# Altium project Test Board ESP32-S3 Mini.PrjPcb (part 2 of 2)

## Sheet SD-eMMC.SchDoc
size A4
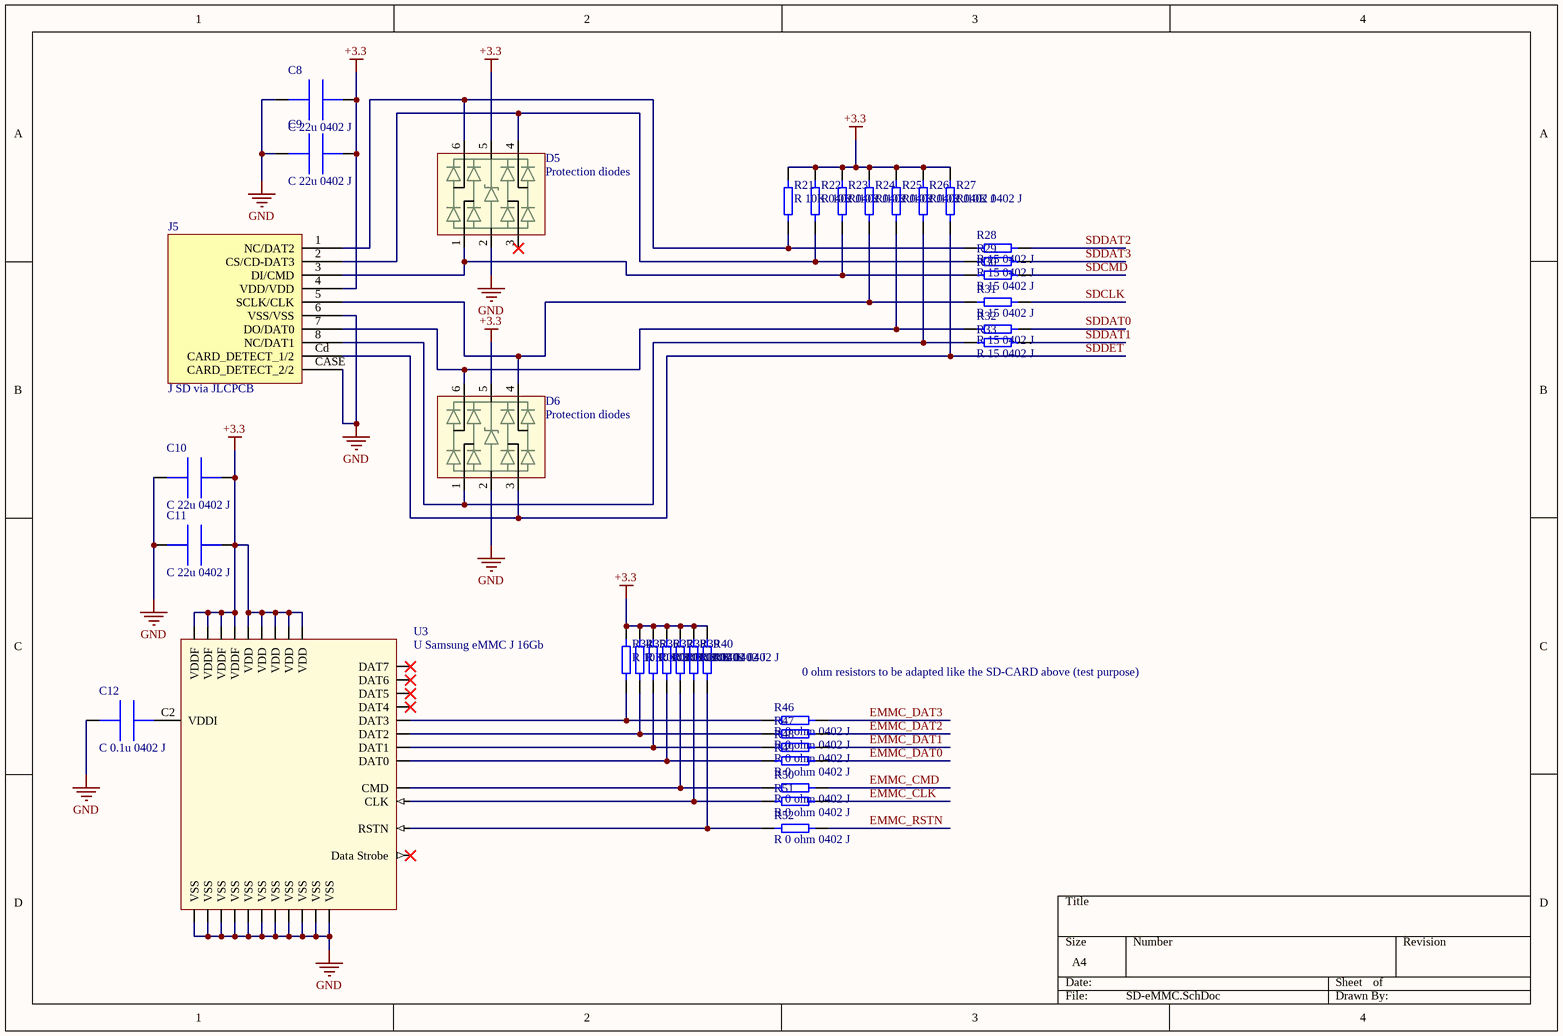
[diagram p3: SD-eMMC.SchDoc]

### Parts
C8  C 22u 0402 J  [C0402]
C9  C 22u 0402 J  [C0402]
C10  C 22u 0402 J  [C0402]
C11  C 22u 0402 J  [C0402]
C12  C 0.1u 0402 J  [C0402]
D5  Protection diodes  [SOT23-SRV05]
D6  Protection diodes  [SOT23-SRV05]
J5  J SD via JLCPCB  [SOFNG TF-15X15 SD JLCPCB]
R21  R 10K 0402 J  [R0402]
R22  R 10K 0402 J  [R0402]
R23  R 10K 0402 J  [R0402]
R24  R 10K 0402 J  [R0402]
R25  R 10K 0402 J  [R0402]
R26  R 10K 0402 J  [R0402]
R27  R 10K 0402 J  [R0402]
R28  R 15 0402 J  [R0402]
R29  R 15 0402 J  [R0402]
R30  R 15 0402 J  [R0402]
R31  R 15 0402 J  [R0402]
R32  R 15 0402 J  [R0402]
R33  R 15 0402 J  [R0402]
R34  R 10K 0402 J  [R0402]
R35  R 10K 0402 J  [R0402]
R36  R 10K 0402 J  [R0402]
R37  R 10K 0402 J  [R0402]
R38  R 10K 0402 J  [R0402]
R39  R 10K 0402 J  [R0402]
R40  R 10K 0402 J  [R0402]
R46  R 0 ohm 0402 J  [R0402]
R47  R 0 ohm 0402 J  [R0402]
R48  R 0 ohm 0402 J  [R0402]
R49  R 0 ohm 0402 J  [R0402]
R50  R 0 ohm 0402 J  [R0402]
R51  R 0 ohm 0402 J  [R0402]
R52  R 0 ohm 0402 J  [R0402]
U3  U Samsung eMMC J 16Gb  [BGA153C50P14X14_1150X1300X92]

### Nets
+3.3: C8.2 C9.2 C10.2 C11.2 D5.5 D6.5 J5.4(VDD/VDD) R21.2 R22.2 R23.2 R24.2 R25.2 R26.2 R27.2 R34.2 R35.2 R36.2 R37.2 R38.1 R39.2 R40.1 U3.C6(VDD) U3.E6(VDDF) U3.F5(VDDF) U3.J10(VDDF) U3.K9(VDDF) U3.M4(VDD) U3.N4(VDD) U3.P3(VDD) U3.P5(VDD)
GND: C8.1 C9.1 C10.1 C11.1 C12.1 D5.2 D6.2 J5.6(VSS/VSS) J5.CASE(CARD_DETECT_2/2) U3.A6(VSS) U3.C4(VSS) U3.E7(VSS) U3.G5(VSS) U3.H10(VSS) U3.J5(VSS) U3.K8(VSS) U3.N2(VSS) U3.N5(VSS) U3.P4(VSS) U3.P6(VSS)
EMMC_CLK: R51.2
EMMC_CMD: R50.2
EMMC_DAT0: R49.2
EMMC_DAT1: R48.2
EMMC_DAT2: R47.2
EMMC_DAT3: R46.2
EMMC_RSTN: R52.2
SDCLK: R31.2
SDCMD: R30.2
SDDAT0: R32.2
SDDAT1: R33.2
SDDAT2: R28.2
SDDAT3: R29.2
SDDET: D6.3 J5.Cd(CARD_DETECT_1/2) R27.1
NetC12_2: C12.2 U3.C2(VDDI)
NetD5_1: D5.1 J5.3(DI/CMD) R23.1 R30.1
NetD5_4: D5.4 J5.2(CS/CD-DAT3) R22.1 R29.1
NetD5_6: D5.6 J5.1(NC/DAT2) R21.1 R28.1
NetD6_1: D6.1 J5.8(NC/DAT1) R26.1 R33.1
NetD6_4: D6.4 J5.5(SCLK/CLK) R24.1 R31.1
NetD6_6: D6.6 J5.7(DO/DAT0) R25.1 R32.1
NetR34_1: R34.1 R46.1 U3.B2(DAT3)
NetR35_1: R35.1 R47.1 U3.A5(DAT2)
NetR36_1: R36.1 R48.1 U3.A4(DAT1)
NetR37_1: R37.1 R49.1 U3.A3(DAT0)
NetR38_2: R38.2 R50.1 U3.M5(CMD)
NetR39_1: R39.1 R51.1 U3.M6(CLK)
NetR40_2: R40.2 R52.1 U3.K5(RSTN)

Not connected (* = marked no-connect by the designer): D5 3*; U3 B3(DAT4)* B4(DAT5)* B5(DAT6)* B6(DAT7)* H5(Data_Strobe)*

### Notes on the sheet
- 0 ohm resistors to be adapted like the SD-CARD above (test purpose)

### Library data of the parts
C8-C11 = C 22u 0402 J: Multi-Layer Ceramic Capacitor 22uF 2.5VDC X6S 20% 0402 Paper T/R GRM155C80E226ME11D; Manufacturer: Murata; Supplier 1: Mouser; Manufacturer Part Number: GRM155C80E226ME11D; RoHS: Yes; Category: Ceramic Capacitors; Stock 1: 30000; Pricing 1: 1=0,32000, 10=0,22300, 50=0,22300, 100=0,13400, 1000=0,08500, 10000=0,06900 (USD); Supplier Part Number 1: 81-GRM155C80E226ME1D; JLCPCB: C907955
C12 = C 0.1u 0402 J: Cap Ceramic 0.1uF 50V X7R 10% Pad SMD 0402 125C Low ESR Automotive CL05B104KB54PNC; Manufacturer: Samsung; Supplier 1: Digi-Key; Manufacturer Part Number: CL05B104KB54PNC; RoHS: Yes; Category: Ceramic Capacitors; Stock 1: 3863336; Pricing 1: 1=0,10000, 10=0,04600, 50=0,02500, 100=0,02040, 500=0,01460, 1000=0,01147, 2500=0,01043, 5000=0,00959 (USD); RoHS Compliant: Yes; Supplier Part Number 1: 1276-CL05B104KB54PNCCT-ND; JLCPCB: C307331
D5 D6 = D SRV05-4.TCT: SEMTECH - SRV05-4.TCT - ESD Protection Device, TVS, 17.5 V, SOT-23, 6 Pins, 5 V, 300 W; Capacitance: 5pF; Direction: Unidirectional; Reverse Breakdown Voltage: 6V; Number of Elements: 1; Number of Channels: 4; Operating Supply Voltage: 5V; Clamping Voltage: 17.5V; Peak Pulse Power: 300W; Power Line Protection: Yes; Leakage Current: 5uA; Peak Pulse Current: 12A; Test Current: 1mA; Current: 5A; Supplier 1: RSComponents; Manufacturer: Semtech; Manufacturer Part Number: SRV05-4.TCT; RoHS: Yes; Category: TVS Diodes; Stock 1: 425; Pricing 1: 5=1,18100, 25=0,88900, 50=0,77200, 125=0,72400, 250=0,69400 (USD); Mount: Surface Mount; Case/Package: SOT-23; Number of Pins: 6; Min Operating Temperature: -55°C; Max Operating Temperature: 125°C; Packaging: Tape and Reel; Number of Bidirectional Channels: 4; Reverse Standoff Voltage: 5V; Min Breakdown Voltage: 6V; Polarity: Unidirectional; Working Voltage: 5V; ESD Protection: Yes; Max Reverse Leakage Current: 5uA; Max Breakdown Voltage: 6V; Max Power Dissipation: 300W; Voltage Rating (DC): 5V; Breakdown Voltage: 6V; Voltage: 5V; Series: RailClamp®, SR; Clamping Voltage-Max: 17.5V; Length: 2.9mm; Width: 1.6mm; Height: 1.15mm; Depth: 1.6mm; Radiation Hardening: No; REACH SVHC: No SVHC; Lead Free: Lead Free; RoHS Compliant: Yes; ComponentLink1URL: https://datasheet.ciiva.com/18065/getdatasheetpartid-93542-18065216.pdf?src-supplier=Verical; ComponentLink1Description: https://datasheet.ciiva.com/18065/getdatasheetpartid-93542-18065216.pdf?src-supplier=Verical; ComponentLink2URL: https://datasheet.ciiva.com/8029/srv05-4-8029973.pdf?src-supplier=Element14; ComponentLink2Description: https://datasheet.ciiva.com/8029/srv05-4-8029973.pdf?src-supplier=Element14; ComponentLink3URL: https://datasheet.ciiva.com/26787/srv05-4-tct-26787453.pdf?src-supplier=IIIC; ComponentLink3Description: https://datasheet.ciiva.com/26787/srv05-4-tct-26787453.pdf?src-supplier=IIIC; ComponentLink4URL: https://datasheet.ciiva.com/11193/srv05-4-11193639.pdf?src-supplier=Avnet; ComponentLink4Description: https://datasheet.ciiva.com/11193/srv05-4-11193639.pdf?src-supplier=Avnet; ComponentLink5URL: https://datasheet.ciiva.com/16396/srv05-4-16396600.pdf?src-supplier=Future+Electronics; ComponentLink5Description: https://datasheet.ciiva.com/16396/srv05-4-16396600.pdf?src-supplier=Future+Electronics; ComponentLink6URL: https://datasheet.ciiva.com/25955/srv05-4-25955769.pdf?src-supplier=Avnet+Europe; ComponentLink6Description: https://datasheet.ciiva.com/25955/srv05-4-25955769.pdf?src-supplier=Avnet+Europe; ComponentLink7URL: https://datasheet.ciiva.com/338/srv05-4-338860.pdf?src-supplier=Digi-Key; ComponentLink7Description: https://datasheet.ciiva.com/338/srv05-4-338860.pdf?src-supplier=Digi-Key; ComponentLink8URL: https://datasheet.ciiva.com/338/srv05-4-338861.pdf?src-supplier=Digi-Key; ComponentLink8Description: https://datasheet.ciiva.com/338/srv05-4-338861.pdf?src-supplier=Digi-Key; ComponentLink9URL: https://datasheet.ciiva.com/338/srv05-4-338862.pdf?src-supplier=Digi-Key; ComponentLink9Description: https://datasheet.ciiva.com/338/srv05-4-338862.pdf?src-supplier=Digi-Key; Supplier Part Number 1: 6910883; JLCPCB: C13612
J5 = J SD via JLCPCB: Deck MicroSD card (TF card) Self bomb SMD SD Card Connectors ROHS; Manufacturer: SOFNG; Manufacturer Part Number: TF-15x15; JLCPCB: C111196
R21-R27 R34-R40 = R 10K 0402 J: Res Thick Film 0402 10K Ohm 1% 0.063W(1/16W) ±100ppm/C Pad SMD Automotive T/R AC0402FR-0710KL; Manufacturer: Yageo; Resistance: 10kR; Power Rating: 62.5mW; Voltage Rating: 50V; Temperature Coefficient: 100ppm/°C; Max Power Dissipation: 63mW; Supplier 1: Arrow Electronics; Manufacturer Part Number: AC0402FR-0710KL; RoHS: Yes; Category: Chip SMD Resistors; Stock 1: 46; Pricing 1: 1=0,08140, 10=0,02850, 25=0,02750 (USD); Case/Package: 0402; Case Code (Imperial): 0402; Case Code (Metric): 1005; Size Code: 0402; Min Operating Temperature: -55°C; Max Operating Temperature: 155°C; Tolerance: 1%; Packaging: Tape and Reel; Resistor Type: Thick Film; Termination: SMD/SMT; Number of Terminations: 2; Features: Moisture Resistant,Automotive AEC-Q200; Series: AC; Construction: Rectangular; Length: 0.039inch; Width: 0.02inch; Height: 0.015inch; Depth: 0.5mm; Military Standard: Not; Lead Free: Lead Free; RoHS Compliant: Yes; ComponentLink1URL: https://datasheet.ciiva.com/12656/pyu-ac-51-rohs-l-2-12656634.pdf?src-supplier=Mouser; ComponentLink1Description: https://datasheet.ciiva.com/12656/pyu-ac-51-rohs-l-2-12656634.pdf?src-supplier=Mouser; Supplier 2: RSComponents; Stock 2: 17000; Pricing 2: 10000=0,00200 (GBP); Supplier 3: Digi-Key; Stock 3: 1574588; Pricing 3: 1=0,10000, 10=0,02000, 100=0,00830, 1000=0,00371, 2500=0,00322, 5000=0,00266 (USD); Supplier 4: Mouser; Stock 4: 3990115; Pricing 4: 1=0,10000, 10=0,01500, 50=0,01500, 100=0,00700, 1000=0,00300, 5000=0,00200, 10000=0,00200 (USD); Supplier Part Number 1: AC0402FR-0710KL; Supplier Part Number 2: 1977965; Supplier Part Number 3: YAG3436CT-ND; Supplier Part Number 4: 603-AC0402FR-0710KL; JLCPCB: C144807
R28-R33 = R 15 0402 J: Res Thick Film 0402 15 Ohm 5% 1/10W ±200ppm/°C Molded SMD Punched Carrier T/R ERJ-2GEJ150X; Manufacturer: Panasonic; Resistance: 15R; Voltage Rating: 50V; Power Rating: 100mW; Supplier 1: Arrow Electronics; Manufacturer Part Number: ERJ-2GEJ150X; RoHS: Yes; Category: Chip SMD Resistors; Stock 1: 8902; Pricing 1: 1=0,04910, 10=0,01270, 25=0,00660, 100=0,00350, 250=0,00340, 3000=0,00330 (USD); Mount: Surface Mount; Case/Package: 0402; Contact Plating: Tin; Case Code (Imperial): 0402; Case Code (Metric): 1005; Min Operating Temperature: -55°C; Max Operating Temperature: 155°C; Tolerance: 5%; Resistor Type: Thick Film; Temperature Coefficient: 200ppm/°C; Packaging: Tape and Reel; Package Quantity: 1; Termination: SMD/SMT; Number of Terminations: 2; Max Power Dissipation: 100mW; Voltage Rating (DC): 50V; Features: Automotive AEC-Q200; Series: ERJ; Resistance Tolerance: 5%; Technology: THICK FILM; Construction: Rectangular; Length: 1mm; Width: 0.5mm; Height: 0.35mm; Depth: 0.5mm; Radiation Hardening: No; REACH SVHC: No SVHC; Military Standard: Not; Lead Free: Lead Free; RoHS Compliant: Yes; ComponentLink1URL: https://datasheet.ciiva.com/11821/0900766b80f806dd-11821198.pdf?src-supplier=RSComponents; ComponentLink1Description: https://datasheet.ciiva.com/11821/0900766b80f806dd-11821198.pdf?src-supplier=RSComponents; ComponentLink2URL: https://datasheet.ciiva.com/8081/aoa0000ce1-8081306.pdf?src-supplier=Element14; ComponentLink2Description: https://datasheet.ciiva.com/8081/aoa0000ce1-8081306.pdf?src-supplier=Element14; ComponentLink3URL: https://datasheet.ciiva.com/43470/1678796-43470027.pdf?src-supplier=Farnell; ComponentLink3Description: https://datasheet.ciiva.com/43470/1678796-43470027.pdf?src-supplier=Farnell; ComponentLink4URL: https://datasheet.ciiva.com/46380/1678796-46380221.pdf?src-supplier=Element14; ComponentLink4Description: https://datasheet.ciiva.com/46380/1678796-46380221.pdf?src-supplier=Element14; ComponentLink5URL: https://datasheet.ciiva.com/16774/70260739-16774952.pdf?src-supplier=Allied+Electronics; ComponentLink5Description: https://datasheet.ciiva.com/16774/70260739-16774952.pdf?src-supplier=Allied+Electronics; ComponentLink6URL: https://datasheet.ciiva.com/9119/aoa0000ce1-9119005.pdf?src-supplier=Avnet; ComponentLink6Description: https://datasheet.ciiva.com/9119/aoa0000ce1-9119005.pdf?src-supplier=Avnet; Supplier 2: Mouser; Stock 2: 72720; Pricing 2: 1=0,10000, 10=0,02900, 50=0,02900, 100=0,01200, 1000=0,00600, 2500=0,00500, 5000=0,00400, 10000=0,00400 (USD); Supplier 3: RSComponents; JLCPCB: C412910; Supplier Part Number 1: ERJ-2GEJ150X; Supplier Part Number 2: 667-ERJ-2GEJ150X; Supplier Part Number 3: 7324921
R46-R52 = R 0 ohm 0402 J: RC Series 0402 0.063 W 0 Ohm Jumper Surface Mount Thick Film Chip Resistor RC0402FR-070RL; Manufacturer: Yageo; Resistance: 0R; Tolerance: 1%; Power Rating: 62.5mW; Voltage Rating: 50V; Temperature Coefficient: 200ppm/°C; Max Power Dissipation: 63mW; Supplier 1: Arrow Electronics; Manufacturer Part Number: RC0402FR-070RL; RoHS: Yes; Category: Chip SMD Resistors; Stock 1: 810000; Pricing 1: 10000=0,00120, 30000=0,00110, 50000=0,00100 (USD); Mount: Surface Mount; Case/Package: 0402; Contact Plating: Tin,Matte; Case Code (Imperial): 0402; Case Code (Metric): 1005; Size Code: 0402; Min Operating Temperature: -55°C; Max Operating Temperature: 155°C; Resistor Type: Thick Film; Packaging: Tape and Reel; Termination: SMD/SMT; Features: Moisture Resistant; Series: RC; Number of Terminations: 2; Length: 1mm; Width: 0.5mm; Height: 0.35mm; Radiation Hardening: No; Lead Free: Lead Free; RoHS Compliant: Yes; ComponentLink1URL: https://datasheet.ciiva.com/8896/pyu-rc0402-51-rohs-l-6-8896149.pdf?src-supplier=Avnet; ComponentLink1Description: https://datasheet.ciiva.com/8896/pyu-rc0402-51-rohs-l-6-8896149.pdf?src-supplier=Avnet; ComponentLink2URL: https://datasheet.ciiva.com/16790/pyu-rc0402-51-rohs-l-6-r-16790444.pdf?src-supplier=Future+Electronics; ComponentLink2Description: https://datasheet.ciiva.com/16790/pyu-rc0402-51-rohs-l-6-r-16790444.pdf?src-supplier=Future+Electronics; Supplier 2: Digi-Key; Stock 2: 9382775; Pricing 2: 1=0,10000, 10=0,01200, 25=0,00840, 50=0,00640, 100=0,00480, 250=0,00364, 500=0,00290, 1000=0,00214, 5000=0,00154 (USD); Supplier 3: Mouser; Stock 3: 8133261; Pricing 3: 1=0,10000, 10=0,01400, 50=0,01400, 100=0,00600, 1000=0,00300, 5000=0,00200, 10000=0,00100 (USD); JLCPCB: C106231; Supplier Part Number 1: RC0402FR-070RL; Supplier Part Number 2: 311-0.0LRCT-ND; Supplier Part Number 3: 603-RC0402FR-070RL
U3 = U Samsung eMMC J 16Gb: KLMAG1JETD-B041 16Gbit -25℃~+85℃ 2.7V~3.6V eMMC 5.1 FBGA-153 eMMC ROHS; Supplier 1: Arrow Electronics; Manufacturer: Samsung; Manufacturer Part Number: KLMAG1JETD-B041; RoHS: No; JLCPCB: C499919; Supplier Part Number 1: KLMAG1JETD-B0410

## Sheet MIC.SchDoc
size A4
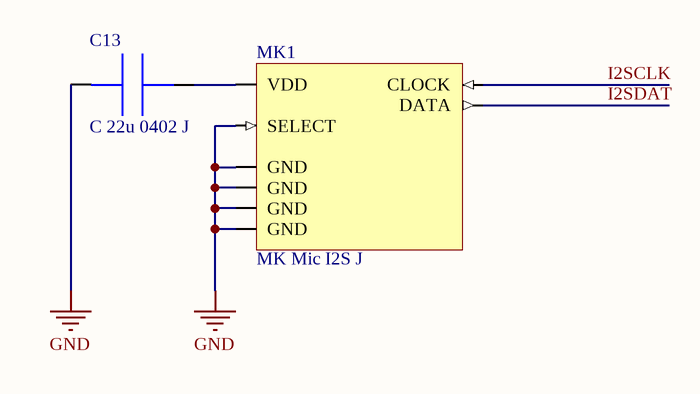
[diagram p4: MIC.SchDoc]

### Parts
C13  C 22u 0402 J  [C0402]
MK1  MK Mic I2S J  [MK WMM7040DTHN0]

### Nets
GND: C13.1 MK1.2(SELECT) MK1.5(GND) MK1.6(GND) MK1.7(GND) MK1.8(GND)
I2SCLK: MK1.3(CLOCK)
I2SDAT: MK1.4(DATA)
NetC13_2: C13.2 MK1.1(VDD)

### Library data of the parts
C13 = C 22u 0402 J: as C8 on sheet SD-eMMC; Supplier 1: Mouser; Manufacturer Part Number: GRM155C80E226ME11D; RoHS: Yes; Category: Ceramic Capacitors; Stock 1: 30000; Pricing 1: 1=0,32000, 10=0,22300, 50=0,22300, 100=0,13400, 1000=0,08500, 10000=0,06900 (USD); Supplier Part Number 1: 81-GRM155C80E226ME1D; JLCPCB: C907955
MK1 = MK Mic I2S J: WILLSEMI(Will Semicon) SMD MEMS Microphones ROHS WMM7040DTHN0; Manufacturer: WILLSEMI(Will Semicon); Manufacturer Part Number: WMM7040DTHN0; JLCPCB: C2937733; ComponentLink1Description: Datasheet; ComponentLink1URL: https://datasheet.lcsc.com/lcsc/2204021130_WILLSEMI-Will-Semicon-WMM7040DTHN0-8-TR_C2937733.pdf

## Sheet Sensors.SchDoc
size A4
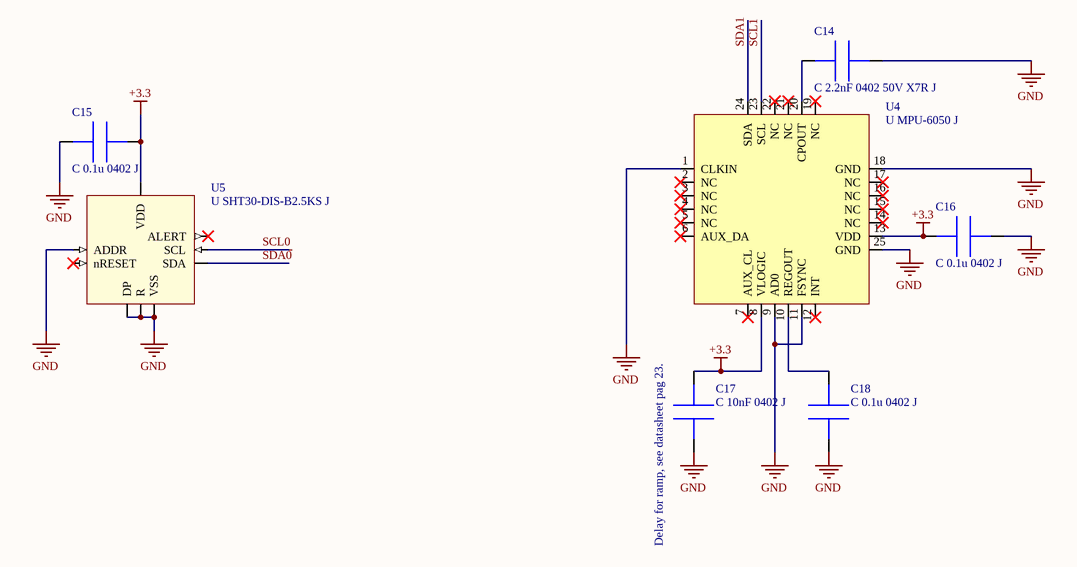
[diagram p5: Sensors.SchDoc]

### Parts
C14  C 2.2nF 0402 50V X7R J  [C0402]
C15  C 0.1u 0402 J  [C0402]
C16  C 0.1u 0402 J  [C0402]
C17  C 10nF 0402 J  [C0402]
C18  C 0.1u 0402 J  [C0402]
U4  U MPU-6050 J  [MPU-6050]
U5  U SHT30-DIS-B2.5KS J  [SHT30]

### Nets
+3.3: C15.2 C16.1 C17.2 U4.8(VLOGIC) U4.13(VDD) U5.5(VDD)
GND: C14.2 C15.1 C16.2 C17.1 C18.1 U4.1(CLKIN) U4.9(AD0) U4.11(FSYNC) U4.18(GND) U4.25(GND) U5.2(ADDR) U5.7(R) U5.8(VSS) U5.DP
SCL0: U5.4(SCL)
SCL1: U4.23(SCL)
SDA~{0}: U5.1(SDA)
SDA1: U4.24(SDA)
NetC14_1: C14.1 U4.20(CPOUT)
NetC18_2: C18.2 U4.10(REGOUT)

Not connected (* = marked no-connect by the designer): U4 2(NC)* 3(NC)* 4(NC)* 5(NC)* 6(AUX_DA)* 7(AUX_CL)* 12(INT)* 14(NC)* 15(NC)* 16(NC)* 17(NC)* 19(NC)* 21(NC)* 22(NC)*; U5 3(ALERT)* 6(nRESET)*

### Notes on the sheet
- Delay for ramp, see datasheet pag 23.

### Library data of the parts
C14 = C 2.2nF 0402 50V X7R J: Cap Ceramic 0.0022uF 50V X7R 10% Pad SMD 0402 125C Automotive T/R AC0402KRX7R9BB222; Manufacturer: Yageo; Supplier 1: Newark; Manufacturer Part Number: AC0402KRX7R9BB222; RoHS: Yes; Category: Ceramic Capacitors; Stock 1: 49560; Pricing 1: 10=0,03200, 25=0,02600, 50=0,02100, 100=0,01600 (USD); Mount: Surface Mount; Case/Package: 0402; Case Code (Imperial): 0402; Case Code (Metric): 1005; Min Operating Temperature: -55°C; Max Operating Temperature: 125°C; Packaging: Tape and Reel; Capacitance: 2.2nF; Tolerance: 10%; Voltage Rating: 50V; Ratings: AEC-Q200; RoHS Compliant: Yes; ComponentLink1URL: http://www.yageo.com/documents/recent/UPY-AC_NP0X7R_16V-to-630V_11.pdf?src-supplier=Digi-Key; ComponentLink1Description: http://www.yageo.com/documents/recent/UPY-AC_NP0X7R_16V-to-630V_11.pdf?src-supplier=Digi-Key; ComponentLink2URL: https://www.yageo.com/upload/media/product/productsearch/datasheet/mlcc/UPY-AC_NP0X7R_16V-to-630V_12.pdf?src-supplier=Digi-Key; ComponentLink2Description: https://www.yageo.com/upload/media/product/productsearch/datasheet/mlcc/UPY-AC_NP0X7R_16V-to-630V_12.pdf?src-supplier=Digi-Key; Supplier 2: Digi-Key; Stock 2: 49626; Pricing 2: 1=0,10000, 10=0,05000, 50=0,02700, 100=0,02210, 500=0,01576, 1000=0,01239, 2500=0,01126, 5000=0,01036 (USD); Supplier 3: Mouser; Stock 3: 49159; Pricing 3: 1=0,10000, 10=0,05600, 50=0,05600, 100=0,02500, 1000=0,01400, 10000=0,01000 (USD); JLCPCB: C309129; Supplier Part Number 1: 69AH6526; Supplier Part Number 2: 311-3072-1-ND; Supplier Part Number 3: 603-AC402KRX7R9BB222
C15 C16 C18 = C 0.1u 0402 J: as C12 on sheet SD-eMMC; Supplier 1: Digi-Key; Manufacturer Part Number: CL05B104KB54PNC; RoHS: Yes; Category: Ceramic Capacitors; Stock 1: 3863336; Pricing 1: 1=0,10000, 10=0,04600, 50=0,02500, 100=0,02040, 500=0,01460, 1000=0,01147, 2500=0,01043, 5000=0,00959 (USD); RoHS Compliant: Yes; Supplier Part Number 1: 1276-CL05B104KB54PNCCT-ND; JLCPCB: C307331
C17 = C 10nF 0402 J: Ceramic capacitor SMD-0402 10nF /50V X7R# K +-10%, Samsung, RoHS CL05B103KB5NNNC; Tolerance: 10%; Voltage Rating: 50V; Dielectric: X7R; Supplier 1: Arrow Electronics; Manufacturer: Samsung; Manufacturer Part Number: CL05B103KB5NNNC; RoHS: Yes; Category: Ceramic Capacitors; Stock 1: 6530000; Pricing 1: 10000=0,00290, 20000=0,00230, 50000=0,00210, 100000=0,00190 (USD); Mount: Surface Mount; Case/Package: 0402; Case Code (Metric): 1005; Case Code (Imperial): 0402; Material: Ceramic; Contact Plating: Tin; Min Operating Temperature: -55°C; Max Operating Temperature: 125°C; Packaging: Tape and Reel; Capacitance: 10nF; Package Quantity: 1; Voltage: 50V; Voltage Rating (DC): 50V; Series: CL; Construction: Flat; Length: 1mm; Width: 0.02inch; Height: 0.5mm; Thickness: 0.022inch; Depth: 0.5mm; Radiation Hardening: No; Lead Free: Lead Free; RoHS Compliant: Yes; ComponentLink1URL: https://datasheet.ciiva.com/15195/getdatasheetpartid-359682-15195636.pdf?src-supplier=Verical; ComponentLink1Description: https://datasheet.ciiva.com/15195/getdatasheetpartid-359682-15195636.pdf?src-supplier=Verical; ComponentLink2URL: https://datasheet.ciiva.com/29198/458761-da-01-en-vs-kondensator-0402-29198432.pdf?src-supplier=Conrad; ComponentLink2Description: https://datasheet.ciiva.com/29198/458761-da-01-en-vs-kondensator-0402-29198432.pdf?src-supplier=Conrad; ComponentLink3URL: https://datasheet.ciiva.com/26309/mlcc-catalogdownload2013-eng-26309005.pdf?src-supplier=Distrelec; ComponentLink3Description: https://datasheet.ciiva.com/26309/mlcc-catalogdownload2013-eng-26309005.pdf?src-supplier=Distrelec; Supplier 2: Digi-Key; Stock 2: 14692768; Pricing 2: 1=0,10000, 10=0,01500, 50=0,00820, 100=0,00670, 500=0,00478, 1000=0,00375, 2500=0,00341, 5000=0,00314 (USD); Supplier 3: Mouser; Stock 3: 2909879; Pricing 3: 1=0,10000, 10=0,00900, 50=0,00900, 100=0,00700, 500=0,00600, 1000=0,00500, 2500=0,00400, 10000=0,00300, 20000=0,00200 (USD); Supplier Part Number 1: CL05B103KB5NNNC; Supplier Part Number 2: 1276-1028-1-ND; Supplier Part Number 3: 187-CL05B103KB5NNNC; JLCPCB: C15195
U4 = U MPU-6050 J: IMU ACCEL/GYRO 3-AXIS I2C 24QFN; Manufacturer: TDK InvenSense; Sensor Type: Accelerometer,Gyroscope,3 Axis; Supplier 1: Avnet; Manufacturer Part Number: MPU-6050; RoHS: Yes; Category: Inertial Measurement Units (IMUs); Pricing 1: 5000=3,94760, 10000=3,89200, 20000=3,78080, 30000=3,69740, 40000=3,55840, 50000=3,47500, 500000=3,39160 (USD); Mount: Surface Mount; Case/Package: QFN; Min Operating Temperature: -40°C; Max Operating Temperature: 85°C; Packaging: Tape and Reel; Output Type: I2C; Series: -; RoHS Compliant: Yes; ComponentLink1URL: https://datasheet.ciiva.com/1513/1788002-1513632.pdf?src-supplier=Element14; ComponentLink1Description: https://datasheet.ciiva.com/1513/1788002-1513632.pdf?src-supplier=Element14; ComponentLink2URL: https://datasheet.ciiva.com/22731/1788002-22731434.pdf?src-supplier=Element14; ComponentLink2Description: https://datasheet.ciiva.com/22731/1788002-22731434.pdf?src-supplier=Element14; JLCPCB: C24112; Supplier Part Number 1: MPU-6050
U5 = U SHT30-DIS-B2.5KS J: Humidity/Temperature Sensor Digital Serial (I2C) 8-Pin DFN EP T/R SHT30-DIS-B2.5KS; Manufacturer: Sensirion; Supplier 1: Arrow Electronics; Manufacturer Part Number: SHT30-DIS-B2.5KS; RoHS: Yes; Category: Temperature and Humidity Sensors; Stock 1: 90000; Pricing 1: 2500=1,79820 (USD); RoHS Compliant: Yes; ComponentLink1URL: https://media.digikey.com/pdf/Data%20Sheets/Sensirion%20PDFs/HT_DS_SHT3x_DIS.pdf?src-supplier=Digi-Key; ComponentLink1Description: https://media.digikey.com/pdf/Data%20Sheets/Sensirion%20PDFs/HT_DS_SHT3x_DIS.pdf?src-supplier=Digi-Key; Supplier 2: Digi-Key; Stock 2: 10530; Pricing 2: 1=3,98000, 5=3,51000, 10=3,10000, 25=2,51560, 50=2,22300, 100=2,16450, 500=1,81350, 1000=1,69650 (USD); Supplier 3: Mouser; Stock 3: 49374; Pricing 3: 1=3,86000, 10=2,45000, 50=2,45000, 100=2,25000, 500=1,90000, 1000=1,78000, 2500=1,71000, 5000=1,57000, 10000=1,55000, 25000=1,52000 (USD); JLCPCB: C77361; Supplier Part Number 1: SHT30-DIS-B2.5KS; Supplier Part Number 2: 1649-1009-1-ND; Supplier Part Number 3: 403-SHT30-DIS-B

## Sheet RS-485.SchDoc
size A4
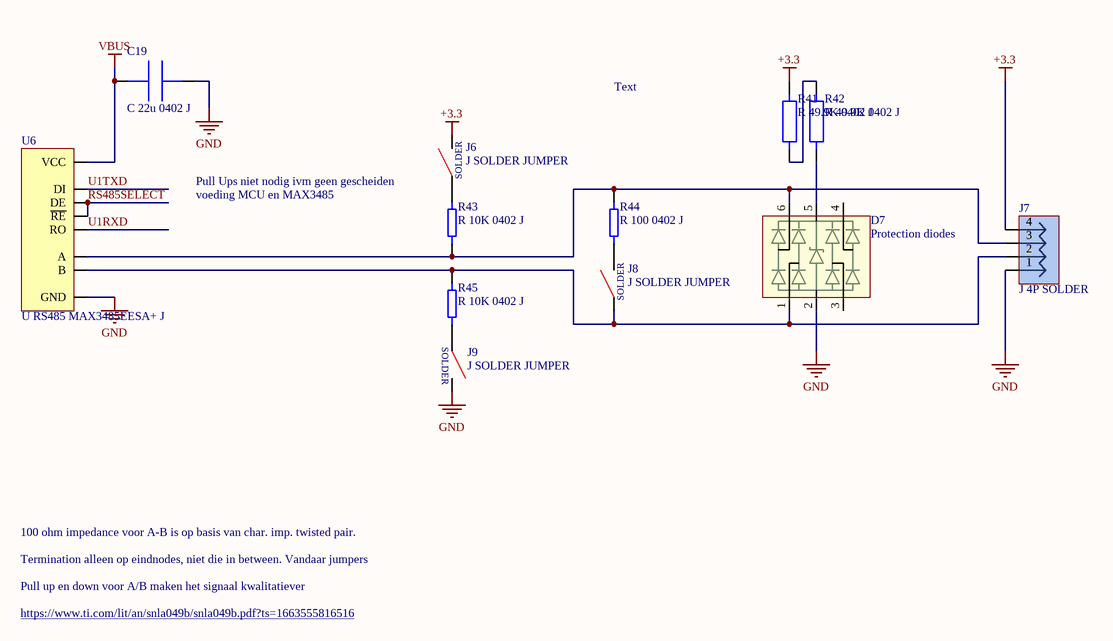
[diagram p6: RS-485.SchDoc]

### Parts
C19  C 22u 0402 J  [C0402]
D7  Protection diodes  [SOT23-SRV05]
J6  J SOLDER JUMPER  [SOLDER_JUMPER]  (no BOM)
J7  J 4P SOLDER  [4P SOLDER BRIDGE]  (no BOM)
J8  J SOLDER JUMPER  [SOLDER_JUMPER]  (no BOM)
J9  J SOLDER JUMPER  [SOLDER_JUMPER]  (no BOM)
R41  R 49.9K 0402 J  [R0402]
R42  R 49.9K 0402 J  [R0402]
R43  R 10K 0402 J  [R0402]
R44  R 100 0402 J  [R0402]
R45  R 10K 0402 J  [R0402]
U6  U RS485 MAX3485EESA+ J  [SOIC8 - V2]

### Nets
+3.3: J6.2 J7.4(SEL) R41.2
GND: C19.2 D7.2 J7.1(VDD) J9.2 U6.5(GND)
VBUS: C19.1 U6.8(VCC)
RS485SELECT: U6.2(~{RE}) U6.3(DE)
U1RXD: U6.1(RO)
U1TXD: U6.4(DI)
NetD7_1: D7.1 J7.2(SDA) J8.1 R45.2 U6.7(B)
NetD7_5: D7.5 R42.1
NetD7_6: D7.6 J7.3(SCL) R43.1 R44.2 U6.6(A)
NetJ6_1: J6.1 R43.2
NetJ8_2: J8.2 R44.1
NetJ9_1: J9.1 R45.1
NetR41_1: R41.1 R42.2

Not connected (* = marked no-connect by the designer): D7 3 4

### Notes on the sheet
- Text
- Pull Ups niet nodig ivm geen gescheiden
- voeding MCU en MAX3485
- 100 ohm impedance voor A-B is op basis van char. imp. twisted pair.
- Termination alleen op eindnodes, niet die in between. Vandaar jumpers
- Pull up en down voor A/B maken het signaal kwalitatiever
- https://www.ti.com/lit/an/snla049b/snla049b.pdf?ts=1663555816516
- (in symbol J SOLDER JUMPER) SOLDER

### Library data of the parts
C19 = C 22u 0402 J: as C8 on sheet SD-eMMC; Supplier 1: Mouser; Manufacturer Part Number: GRM155C80E226ME11D; RoHS: Yes; Category: Ceramic Capacitors; Stock 1: 30000; Pricing 1: 1=0,32000, 10=0,22300, 50=0,22300, 100=0,13400, 1000=0,08500, 10000=0,06900 (USD); Supplier Part Number 1: 81-GRM155C80E226ME1D; JLCPCB: C907955
D7 = D SRV05-4.TCT: as D5 on sheet SD-eMMC; Supplier 1: RSComponents; Manufacturer: Semtech; Manufacturer Part Number: SRV05-4.TCT; RoHS: Yes; Category: TVS Diodes; Stock 1: 425; Pricing 1: 5=1,18100, 25=0,88900, 50=0,77200, 125=0,72400, 250=0,69400 (USD); Mount: Surface Mount; Case/Package: SOT-23; Number of Pins: 6; Min Operating Temperature: -55°C; Max Operating Temperature: 125°C; Packaging: Tape and Reel; Number of Bidirectional Channels: 4; Reverse Standoff Voltage: 5V; Min Breakdown Voltage: 6V; Polarity: Unidirectional; Working Voltage: 5V; ESD Protection: Yes; Max Reverse Leakage Current: 5uA; Max Breakdown Voltage: 6V; Max Power Dissipation: 300W; Voltage Rating (DC): 5V; Breakdown Voltage: 6V; Voltage: 5V; Series: RailClamp®, SR; Clamping Voltage-Max: 17.5V; Length: 2.9mm; Width: 1.6mm; Height: 1.15mm; Depth: 1.6mm; Radiation Hardening: No; REACH SVHC: No SVHC; Lead Free: Lead Free; RoHS Compliant: Yes; ComponentLink1URL: https://datasheet.ciiva.com/18065/getdatasheetpartid-93542-18065216.pdf?src-supplier=Verical; ComponentLink1Description: https://datasheet.ciiva.com/18065/getdatasheetpartid-93542-18065216.pdf?src-supplier=Verical; ComponentLink2URL: https://datasheet.ciiva.com/8029/srv05-4-8029973.pdf?src-supplier=Element14; ComponentLink2Description: https://datasheet.ciiva.com/8029/srv05-4-8029973.pdf?src-supplier=Element14; ComponentLink3URL: https://datasheet.ciiva.com/26787/srv05-4-tct-26787453.pdf?src-supplier=IIIC; ComponentLink3Description: https://datasheet.ciiva.com/26787/srv05-4-tct-26787453.pdf?src-supplier=IIIC; ComponentLink4URL: https://datasheet.ciiva.com/11193/srv05-4-11193639.pdf?src-supplier=Avnet; ComponentLink4Description: https://datasheet.ciiva.com/11193/srv05-4-11193639.pdf?src-supplier=Avnet; ComponentLink5URL: https://datasheet.ciiva.com/16396/srv05-4-16396600.pdf?src-supplier=Future+Electronics; ComponentLink5Description: https://datasheet.ciiva.com/16396/srv05-4-16396600.pdf?src-supplier=Future+Electronics; ComponentLink6URL: https://datasheet.ciiva.com/25955/srv05-4-25955769.pdf?src-supplier=Avnet+Europe; ComponentLink6Description: https://datasheet.ciiva.com/25955/srv05-4-25955769.pdf?src-supplier=Avnet+Europe; ComponentLink7URL: https://datasheet.ciiva.com/338/srv05-4-338860.pdf?src-supplier=Digi-Key; ComponentLink7Description: https://datasheet.ciiva.com/338/srv05-4-338860.pdf?src-supplier=Digi-Key; ComponentLink8URL: https://datasheet.ciiva.com/338/srv05-4-338861.pdf?src-supplier=Digi-Key; ComponentLink8Description: https://datasheet.ciiva.com/338/srv05-4-338861.pdf?src-supplier=Digi-Key; ComponentLink9URL: https://datasheet.ciiva.com/338/srv05-4-338862.pdf?src-supplier=Digi-Key; ComponentLink9Description: https://datasheet.ciiva.com/338/srv05-4-338862.pdf?src-supplier=Digi-Key; Supplier Part Number 1: 6910883; JLCPCB: C13612
J8 = J SOLDER JUMPER: No-BOM solder jumper (test method)
R41 R42 = R 49.9K 0402 J: Res General Purpose Thick Film 0402 49.9K Ohm 1% 1/16W ±100ppm/°C Molded SMD Paper T/R RC0402FR-0749K9L; Manufacturer: Yageo; Power Rating: 62.5mW; Resistance: 49.9kR; Voltage Rating: 50V; Max Power Dissipation: 63mW; Supplier 1: Arrow Electronics; Manufacturer Part Number: RC0402FR-0749K9L; RoHS: Yes; Category: Chip SMD Resistors; Stock 1: 3590000; Pricing 1: 10000=0,00180, 30000=0,00160, 50000=0,00140, 100000=0,00140 (USD); Case/Package: 0402; Case Code (Imperial): 0402; Case Code (Metric): 1005; Size Code: 0402; Min Operating Temperature: -55°C; Max Operating Temperature: 155°C; Tolerance: 1%; Packaging: Tape and Reel; Termination: SMD/SMT; Resistor Type: Thick Film; Temperature Coefficient: 100ppm/°C; Voltage Rating (DC): 50V; Features: Moisture Resistant; Series: RC; Number of Terminations: 2; Construction: Rectangular; Length: 1mm; Depth: 0.5mm; Military Standard: Not; Lead Free: Lead Free; RoHS Compliant: Yes; ComponentLink1URL: https://datasheet.ciiva.com/17071/pyu-rc0402-51-rohs-l-6-r-17071066.pdf?src-supplier=Future+Electronics; ComponentLink1Description: https://datasheet.ciiva.com/17071/pyu-rc0402-51-rohs-l-6-r-17071066.pdf?src-supplier=Future+Electronics; Supplier 2: RSComponents; Stock 2: 9900; Pricing 2: 10000=0,00200, 50000=0,00200, 100000=0,00200, 200000=0,00200, 400000=0,00200 (GBP); Supplier 3: Digi-Key; Stock 3: 8421822; Pricing 3: 1=0,10000, 10=0,01500, 100=0,00610, 1000=0,00275, 2500=0,00239, 5000=0,00197 (USD); Supplier 4: Mouser; Stock 4: 1268211; Pricing 4: 1=0,10000, 10=0,01800, 50=0,01800, 100=0,00800, 1000=0,00500, 10000=0,00200 (USD); JLCPCB: C137969; Supplier Part Number 2: 1987804; Supplier Part Number 3: 311-49.9KLRDKR-ND; Supplier Part Number 4: 603-RC0402FR-0749K9L; Supplier Part Number 1: RC0402FR-0749K9L
R43 R45 = R 10K 0402 J: as R21 on sheet SD-eMMC; Supplier 1: Arrow Electronics; Manufacturer Part Number: AC0402FR-0710KL; RoHS: Yes; Category: Chip SMD Resistors; Stock 1: 46; Pricing 1: 1=0,08140, 10=0,02850, 25=0,02750 (USD); Case/Package: 0402; Case Code (Imperial): 0402; Case Code (Metric): 1005; Size Code: 0402; Min Operating Temperature: -55°C; Max Operating Temperature: 155°C; Tolerance: 1%; Packaging: Tape and Reel; Resistor Type: Thick Film; Termination: SMD/SMT; Number of Terminations: 2; Features: Moisture Resistant,Automotive AEC-Q200; Series: AC; Construction: Rectangular; Length: 0.039inch; Width: 0.02inch; Height: 0.015inch; Depth: 0.5mm; Military Standard: Not; Lead Free: Lead Free; RoHS Compliant: Yes; ComponentLink1URL: https://datasheet.ciiva.com/12656/pyu-ac-51-rohs-l-2-12656634.pdf?src-supplier=Mouser; ComponentLink1Description: https://datasheet.ciiva.com/12656/pyu-ac-51-rohs-l-2-12656634.pdf?src-supplier=Mouser; Supplier 2: RSComponents; Stock 2: 17000; Pricing 2: 10000=0,00200 (GBP); Supplier 3: Digi-Key; Stock 3: 1574588; Pricing 3: 1=0,10000, 10=0,02000, 100=0,00830, 1000=0,00371, 2500=0,00322, 5000=0,00266 (USD); Supplier 4: Mouser; Stock 4: 3990115; Pricing 4: 1=0,10000, 10=0,01500, 50=0,01500, 100=0,00700, 1000=0,00300, 5000=0,00200, 10000=0,00200 (USD); Supplier Part Number 1: AC0402FR-0710KL; Supplier Part Number 2: 1977965; Supplier Part Number 3: YAG3436CT-ND; Supplier Part Number 4: 603-AC0402FR-0710KL; JLCPCB: C144807
R44 = R 100 0402 J: Res General Purpose Thick Film 0402 100 Ohm 5% 1/16W ±100ppm/°C Molded SMD Paper T/R RC0402JR-07100RL; Manufacturer: Yageo; Resistance: 100R; Power Rating: 63mW; Voltage Rating: 50V; Supplier 1: Arrow Electronics; Manufacturer Part Number: RC0402JR-07100RL; RoHS: Yes; Category: Chip SMD Resistors; Stock 1: 7500000; Pricing 1: 10000=0,00120, 30000=0,00110, 100000=0,00100 (USD); Case/Package: 0402; Case Code (Metric): 1005; Case Code (Imperial): 0402; Weight: 2.3E-05oz; Size Code: 0402; Min Operating Temperature: -55°C; Max Operating Temperature: 155°C; Tolerance: 5%; Packaging: Tape and Reel; Package Quantity: 1; Resistor Type: Thick Film; Number of Terminations: 2; Termination: SMD/SMT; Max Power Dissipation: 63mW; Temperature Coefficient: 100ppm/°C; Features: Moisture Resistant; Series: RC; Resistance Tolerance: 5%; Construction: Rectangular; Length: 1mm; Width: 0.02inch; Height: 0.016inch; Depth: 0.5mm; REACH SVHC: No SVHC; Military Standard: Not; Lead Free: Lead Free; RoHS Compliant: Yes; ComponentLink1URL: https://datasheet.ciiva.com/46394/1018594-46394943.pdf?src-supplier=Element14; ComponentLink1Description: https://datasheet.ciiva.com/46394/1018594-46394943.pdf?src-supplier=Element14; ComponentLink2URL: https://datasheet.ciiva.com/2452/pyu-r-int-thick-7-2452618.pdf?src-supplier=Digi-Key; ComponentLink2Description: https://datasheet.ciiva.com/2452/pyu-r-int-thick-7-2452618.pdf?src-supplier=Digi-Key; ComponentLink3URL: https://datasheet.ciiva.com/2452/pyu-r-int-thick-7-2452619.pdf?src-supplier=Digi-Key; ComponentLink3Description: https://datasheet.ciiva.com/2452/pyu-r-int-thick-7-2452619.pdf?src-supplier=Digi-Key; ComponentLink4URL: https://datasheet.ciiva.com/2452/pyu-r-int-thick-7-2452617.pdf?src-supplier=Digi-Key; ComponentLink4Description: https://datasheet.ciiva.com/2452/pyu-r-int-thick-7-2452617.pdf?src-supplier=Digi-Key; ComponentLink5URL: https://datasheet.ciiva.com/12577/pyu-rc0402-51-rohs-l-6-r-12577725.pdf?src-supplier=Mouser; ComponentLink5Description: https://datasheet.ciiva.com/12577/pyu-rc0402-51-rohs-l-6-r-12577725.pdf?src-supplier=Mouser; ComponentLink6URL: https://datasheet.ciiva.com/7850/1018594-7850135.pdf?src-supplier=Element14; ComponentLink6Description: https://datasheet.ciiva.com/7850/1018594-7850135.pdf?src-supplier=Element14; ComponentLink7URL: https://datasheet.ciiva.com/7850/1018594-7850134.pdf?src-supplier=Element14; ComponentLink7Description: https://datasheet.ciiva.com/7850/1018594-7850134.pdf?src-supplier=Element14; ComponentLink8URL: https://datasheet.ciiva.com/16740/pyu-rc0402-51-rohs-l-6-r-16740924.pdf?src-supplier=Future+Electronics; ComponentLink8Description: https://datasheet.ciiva.com/16740/pyu-rc0402-51-rohs-l-6-r-16740924.pdf?src-supplier=Future+Electronics; Supplier 2: RSComponents; Stock 2: 25100; Pricing 2: 1000=0,00400, 2500=0,00400, 5000=0,00400, 10000=0,00300 (GBP); Supplier 3: Digi-Key; Stock 3: 12189062; Pricing 3: 1=0,10000, 10=0,01200, 100=0,00500, 1000=0,00225, 2500=0,00195, 5000=0,00161 (USD); Supplier 4: Mouser; Stock 4: 1266422; Pricing 4: 1=0,10000, 10=0,01000, 50=0,01000, 100=0,00500, 1000=0,00200, 10000=0,00100 (USD); JLCPCB: C106233; Supplier Part Number 3: 311-100JRCT-ND; Supplier Part Number 4: 603-RC0402JR-07100RL; Supplier Part Number 1: RC0402JR-07100RL; Supplier Part Number 2: 1987887P
U6 = U RS485 MAX3485EESA+ J: Single Transmitter/Receiver RS-422/RS-485 8-Pin SOIC N; Manufacturer: Maxim; Data Rate: 15Mbps; Number of Receivers: 1; Max Supply Voltage: 3.6V; Min Supply Voltage: 3V; Operating Supply Voltage: 3.3V; Max Power Dissipation: 471mW; Output Current: 20uA; Propagation Delay: 62ns; Interface: RS-422,RS-485; Logic Function: Transceiver; Simplex/Duplex: Half Duplex; Operating Supply Current: 1.1mA; Supplier 1: RSComponents; Manufacturer Part Number: MAX3485EESA+; RoHS: Yes; Category: RS-232 / RS-422 / RS-485 Interface ICs; Stock 1: 4140; Pricing 1: 25=6,27000, 50=5,80800, 125=5,54400 (GBP); Mount: Surface Mount; Case/Package: SOIC; Number of Pins: 8; Contact Plating: Tin,Matte; Weight: 0.019048oz; Min Operating Temperature: -40°C; Max Operating Temperature: 85°C; Packaging: Rail/Tube; Package Quantity: 100; Number of Transmitters: 1; Output Voltage: 3V; Number of Drivers: 1; Number of Transceivers: 1; Series: -; Length: 5mm; Width: 4mm; Height: 1.5mm; Radiation Hardening: No; RoHS Compliant: Yes; REACH SVHC: No SVHC; ComponentLink1URL: https://datasheet.ciiva.com/1714/max3483e-max3491e-1714390.pdf?src-supplier=Digi-Key; ComponentLink1Description: https://datasheet.ciiva.com/1714/max3483e-max3491e-1714390.pdf?src-supplier=Digi-Key; ComponentLink2URL: https://datasheet.ciiva.com/3028/max3483e-max3491e-3028632.pdf?src-supplier=Avnet; ComponentLink2Description: https://datasheet.ciiva.com/3028/max3483e-max3491e-3028632.pdf?src-supplier=Avnet; Supplier 2: Mouser; Pricing 2: 1=7,18000, 10=6,49000, 50=6,19000, 100=5,37000, 1000=5,12000, 10000=5,12000 (USD); Supplier Part Number 1: 1901234P; Supplier Part Number 2: 700-MAX3485EESA; JLCPCB: C9943

## Nets that join several sheets
+3.3: MCU (10 pins), Power (C6.A D2.2 U2.5), SD-eMMC (30 pins), Sensors (6 pins), RS-485 (J6.2 J7.4 R41.2)
GND: MCU (14 pins), Power (7 pins), USB (9 pins), SD-eMMC (20 pins), MIC (6 pins), Sensors (14 pins), RS-485 (5 pins)
VBUS: Power (5 pins), USB (5 pins), RS-485 (C19.1 U6.8)
ACTIVATE_ADC: MCU (U1.9), Power (R12.1)
ADC_MEASURE: MCU (U1.8), Power (R13.1 R14.2)
CC1: MCU (U1.18), USB (R17.2)
CC2: MCU (U1.19), USB (R18.2)
EMMC_CLK: MCU (U1.26), SD-eMMC (R51.2)
EMMC_CMD: MCU (U1.25), SD-eMMC (R50.2)
EMMC_DAT0: MCU (U1.29), SD-eMMC (R49.2)
EMMC_DAT1: MCU (U1.30), SD-eMMC (R48.2)
EMMC_DAT2: MCU (U1.31), SD-eMMC (R47.2)
EMMC_DAT3: MCU (U1.28), SD-eMMC (R46.2)
EMMC_RSTN: MCU (U1.27), SD-eMMC (R52.2)
I2SCLK: MCU (U1.6), MIC (MK1.3)
I2SDAT: MCU (U1.5), MIC (MK1.4)
RS485SELECT: MCU (U1.20), RS-485 (U6.2 U6.3)
SCL0: MCU (R2.1 U1.10), Sensors (U5.4)
SCL1: MCU (R5.1 U1.13), Sensors (U4.23)
SDA~{0}: MCU (R3.1 U1.11), Sensors (U5.1)
SDA1: MCU (R4.1 U1.12), Sensors (U4.24)
SDCLK: MCU (U1.35), SD-eMMC (R31.2)
SDCMD: MCU (U1.36), SD-eMMC (R30.2)
SDDAT0: MCU (U1.34), SD-eMMC (R32.2)
SDDAT1: MCU (U1.33), SD-eMMC (R33.2)
SDDAT2: MCU (U1.38), SD-eMMC (R28.2)
SDDAT3: MCU (U1.37), SD-eMMC (R29.2)
SDDET: MCU (U1.32), SD-eMMC (D6.3 J5.Cd R27.1)
U1RXD: MCU (U1.22), RS-485 (U6.1)
U1TXD: MCU (U1.21), RS-485 (U6.4)
USB_D_N: MCU (U1.23), USB (5 pins)
USB_D_P: MCU (U1.24), USB (5 pins)